# EAGLE design arm shield design (EAGLE 7.2.0)
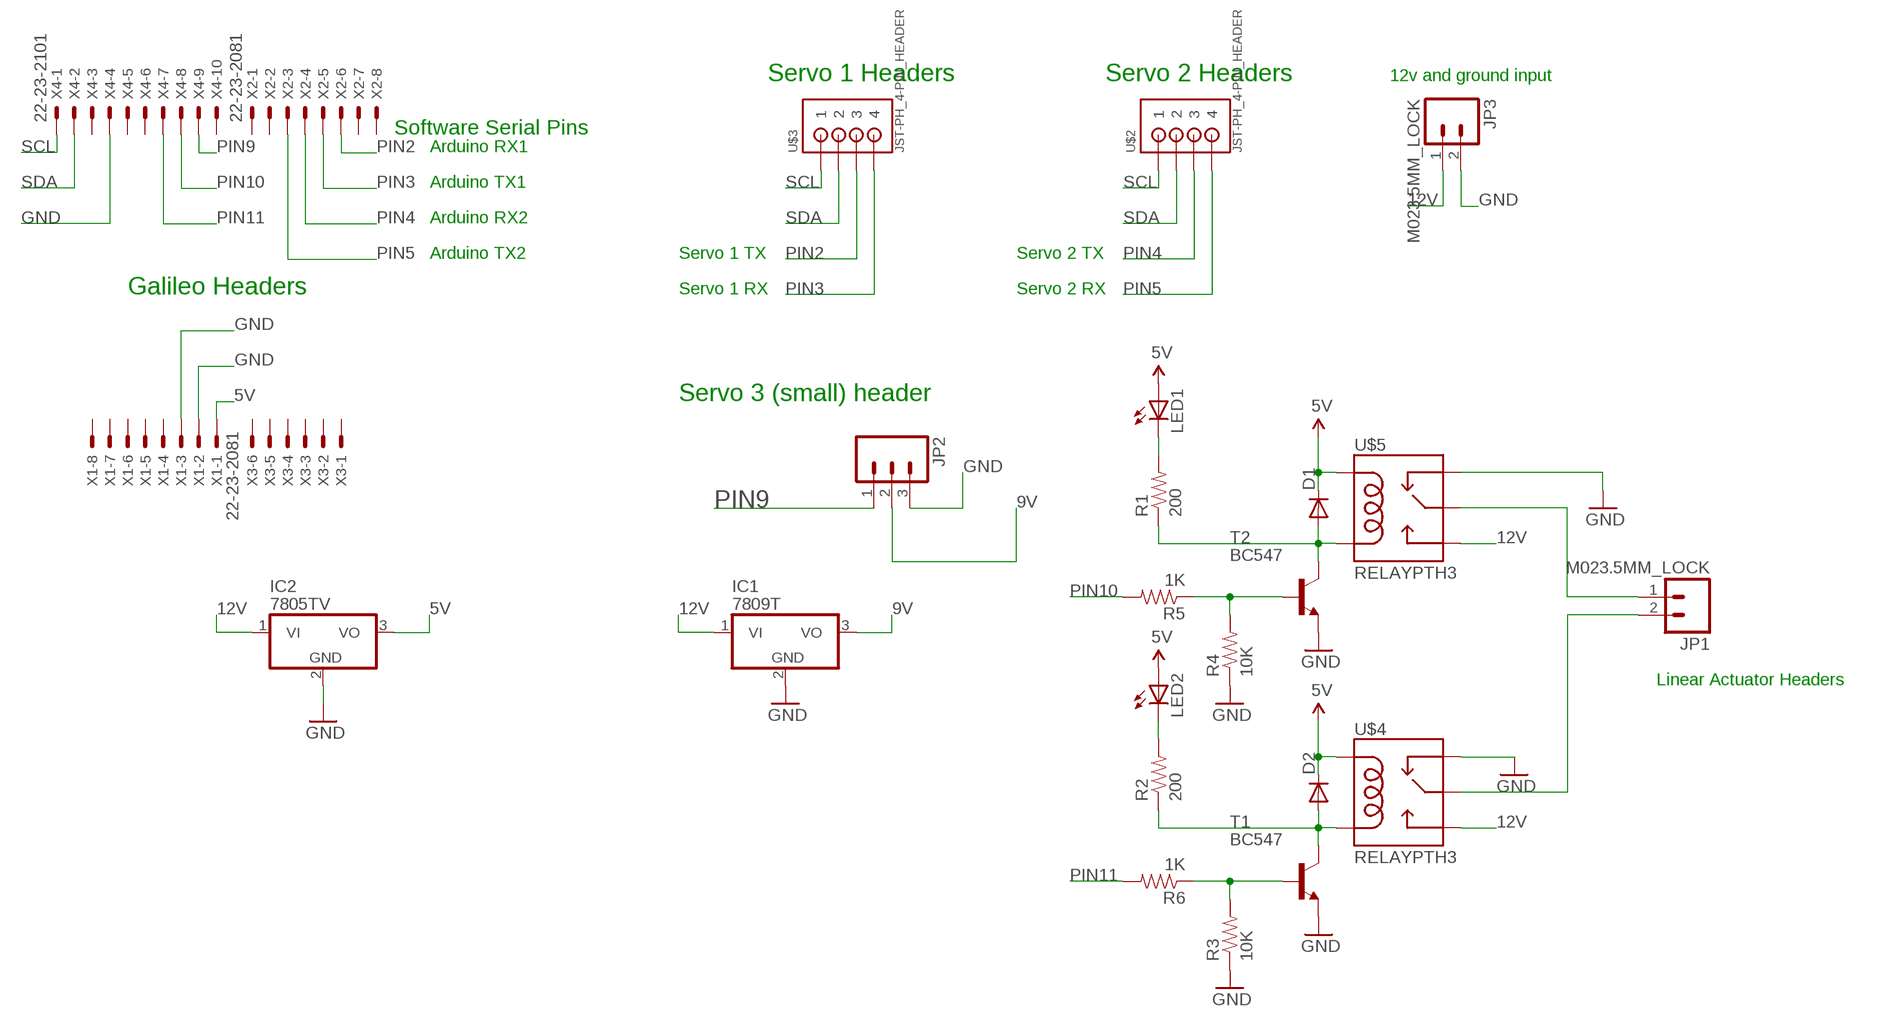
[diagram p0: schematic, sheet 1]

## Parts
D1  DIODE1N4148  [DIODE-1N4148]
D2  DIODE1N4148  [DIODE-1N4148]
IC1  7809T  7805TV  [TO220V]
IC2  7805TV  [TO220V]
JP1  M023.5MM_LOCK  [SCREWTERMINAL-3.5MM-2_LOCK]
JP2  M03PTH  [1X03]
JP3  M023.5MM_LOCK  [SCREWTERMINAL-3.5MM-2_LOCK]
LED1  LED3MM  [LED3MM]
LED2  LED3MM  [LED3MM]
R1  200  RESISTORPTH-1/4W-VERT  [AXIAL-0.1]
R2  200  RESISTORPTH-1/4W-VERT  [AXIAL-0.1]
R3  10K  RESISTORPTH-1/4W-VERT  [AXIAL-0.1]
R4  10K  RESISTORPTH-1/4W-VERT  [AXIAL-0.1]
R5  1K  RESISTORPTH-1/4W-VERT  [AXIAL-0.1]
R6  1K  RESISTORPTH-1/4W-VERT  [AXIAL-0.1]
T1  BC547  [TO92]
T2  BC547  [TO92]
U$2  JST-PH_4-PIN_HEADER  [JST_B4B-PH_HEADER]
U$3  JST-PH_4-PIN_HEADER  [JST_B4B-PH_HEADER]
U$4  RELAYPTH3  [RELAY-T9A-2]
U$5  RELAYPTH3  [RELAY-T9A-2]
X1  22-23-2081  [22-23-2081]
X2  22-23-2081  [22-23-2081]
X3  22-23-2061  [22-23-2061]
X4  22-23-2101  [22-23-2101]

## Nets
5V: D1.C D2.C IC2.3(VO) LED1.A LED2.A U$4.COIL1 U$5.COIL1 X1.1
9V [9VPower]: IC1.3(VO) JP2.2
12V [12VPower]: IC1.1(VI) IC2.1(VI) JP3.1 U$4.NO U$5.NO
GND [12VPower]: IC1.2(GND) IC2.2(GND) JP2.3 JP3.2 R3.P$1 R4.P$1 T1.1(E) T2.1(E) U$4.NC U$5.NC X1.2 X1.3 X4.4
N$1 [12VPower]: JP1.1 U$5.MAIN
N$2 [12VPower]: JP1.2 U$4.MAIN
N$3: D1.A R1.P$1 T2.3(C) U$5.COIL2
N$4: D2.A R2.P$1 T1.3(C) U$4.COIL2
N$5: LED1.K(C) R1.P$2
N$6: R3.P$2 R6.P$1 T1.2(B)
N$7: LED2.K(C) R2.P$2
N$8: R4.P$2 R5.P$1 T2.2(B)
PIN2: U$3.P3 X2.6
PIN3: U$3.P4 X2.5
PIN4: U$2.P3 X2.4
PIN5: U$2.P4 X2.3
PIN9: JP2.1 X4.9
PIN10: R5.P$2 X4.8
PIN11: R6.P$2 X4.7
SCL: U$2.P1 U$3.P1 X4.1
SDA: U$2.P2 U$3.P2 X4.2
Unconnected: X1.4 X1.5 X1.6 X1.7 X1.8 X2.1 X2.2 X2.7 X2.8 X3.1 X3.2 X3.3 X3.4 X3.5 X3.6 X4.3 X4.5 X4.6 X4.10

## Notes on the sheet
- Servo 1 Headers | Servo 2 Headers | 12v and ground input
- Software Serial Pins
- Arduino RX1
- Arduino TX1
- Arduino RX2
- Arduino TX2 | Servo 1 TX | Servo 2 TX
- Galileo Headers | Servo 1 RX | Servo 2 RX
- Servo 3 (small) header
- Linear Actuator Headers

## Library data of the parts
D1 D2 = SparkFun-DiscreteSemi:DIODE: Diode These are standard reverse protection diodes and small signal diodes. SMA package can handle up to about 1A. SOD-323 can handle about 200mA. What the SOD-323 package when ordering, there are some mfgs out there that are 5-pin packages.
IC1 IC2 = linear:78*: Positive VOLTAGE REGULATOR Source: http://cache.national.com/ds/LM/LM78L05.pdf http://www.fairchildsemi.com/ds/LM/LM7805.pdf
JP1 JP3 = SparkFun-Connectors:M02: Standard 2-pin 0.1" header. Use with - straight break away headers ( PRT-00116) - right angle break away headers (PRT-00553) - swiss pins (PRT-00743) - machine pins (PRT-00117) - female headers (PRT-00115) Molex polarized connector foot print use with: PRT-08233 with associated crimp pins and housings. 2.54_SCREWTERM for use with PRT-10571. 3.5mm Screw Terminal footprints for PRT-08084 5mm Screw Terminal footprints for use with PRT-08433
JP2 = SparkFun-Connectors:M03: Header 3 Standard 3-pin 0.1" header. Use with straight break away headers (SKU : PRT-00116), right angle break away headers (PRT-00553), swiss pins (PRT-00743), machine pins (PRT-00117), and female headers (PRT-00115). Molex polarized connector foot print use with SKU : PRT-08232 with associated crimp pins and housings.
LED1 LED2 = SparkFun-LED:LED: LEDs Standard schematic elements and footprints for 5mm, 3mm, 1206, and 0603 sized LEDs. 5mm - Spark Fun Electronics SKU : COM-00529 (and others)
R1-R6 = SparkFun-Resistors:RESISTOR: Resistor Basic schematic elements and footprints for 0603, 1206, and PTH resistors.
T1 T2 = transistor:BC547: NPN TRANSISTOR
U$2 U$3 = SRG:JST-PH_4-PIN_HEADER: 4-pin JST PH Shrouded Header, top entry P/N B4B-PH-K-S Mating connector PHR-4 Mating cable assembly: Sparkfun PRT-09916 <http://www.sparkfun.com/products/9916>; MPN: S4B-PH-K-S(LF)(SN)
U$4 U$5 = SparkFun-Electromechanical:RELAY: SPDT relay (COM-00101)
X1 X2 = con-molex:22-23-2081: .100" (2.54mm) Center Header - 8 Pin; MF: MOLEX; MPN: 22-23-2081; OC_FARNELL: 1756826; OC_NEWARK: 01C7592
X3 = con-molex:22-23-2061: .100" (2.54mm) Center Header - 6 Pin; MF: MOLEX; MPN: 22-23-2061; OC_FARNELL: 1462922; OC_NEWARK: 27C1933
X4 = con-molex:22-23-2101: .100" (2.54mm) Center Header - 10 Pin; MF: MOLEX; MPN: 22-23-2101; OC_FARNELL: 1756828; OC_NEWARK: 94C0765

## Net classes
1 12VPower: width 5.08 mm
2 9VPower: width 1.778 mm

## Board
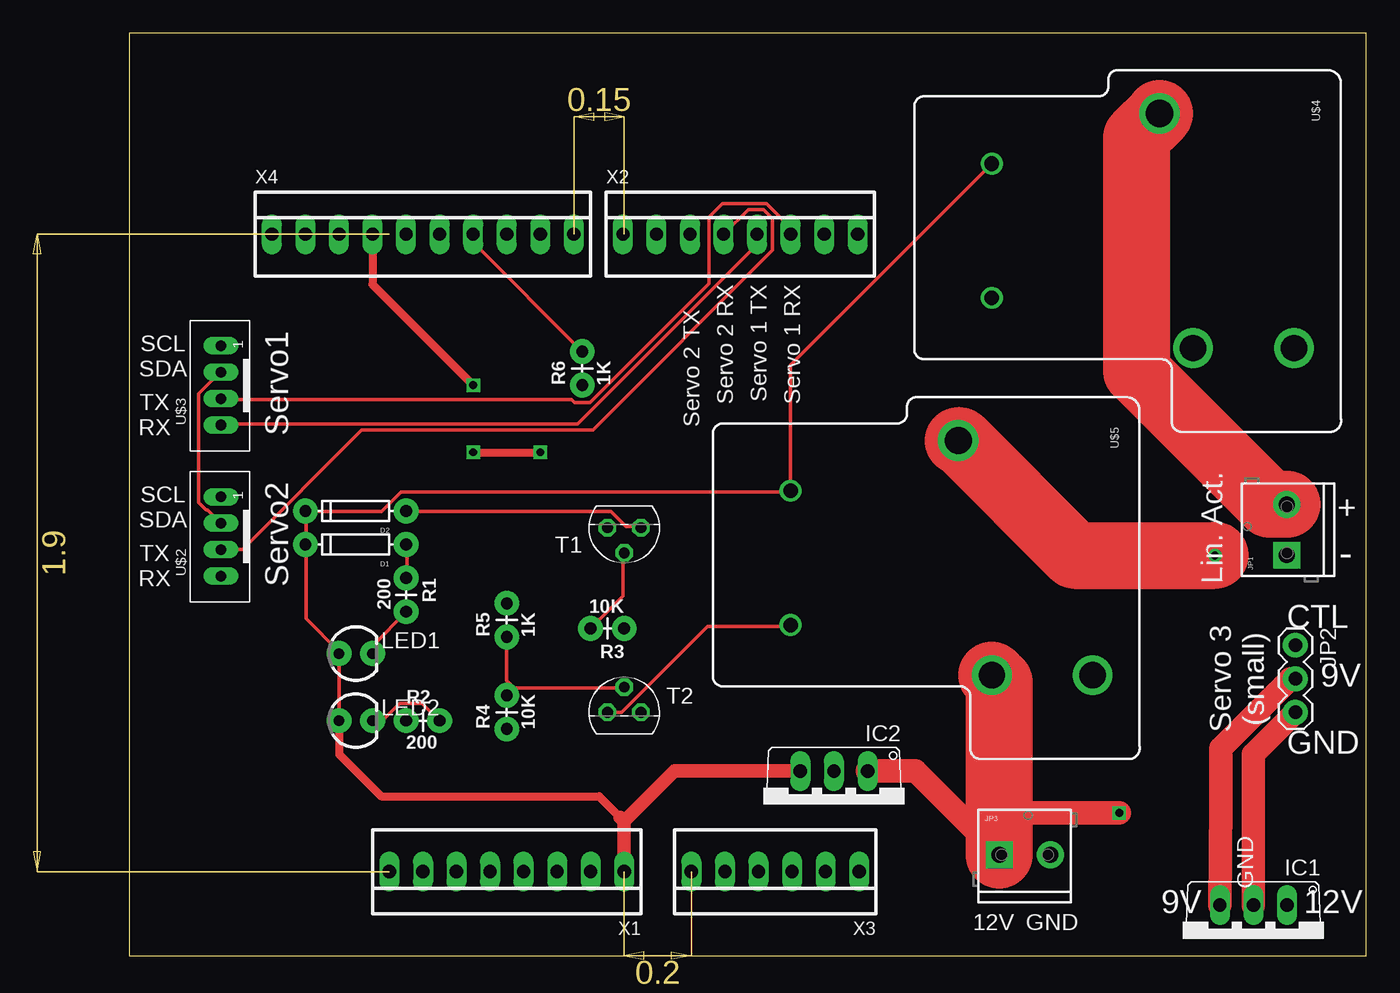
[diagram p1: board, top side]
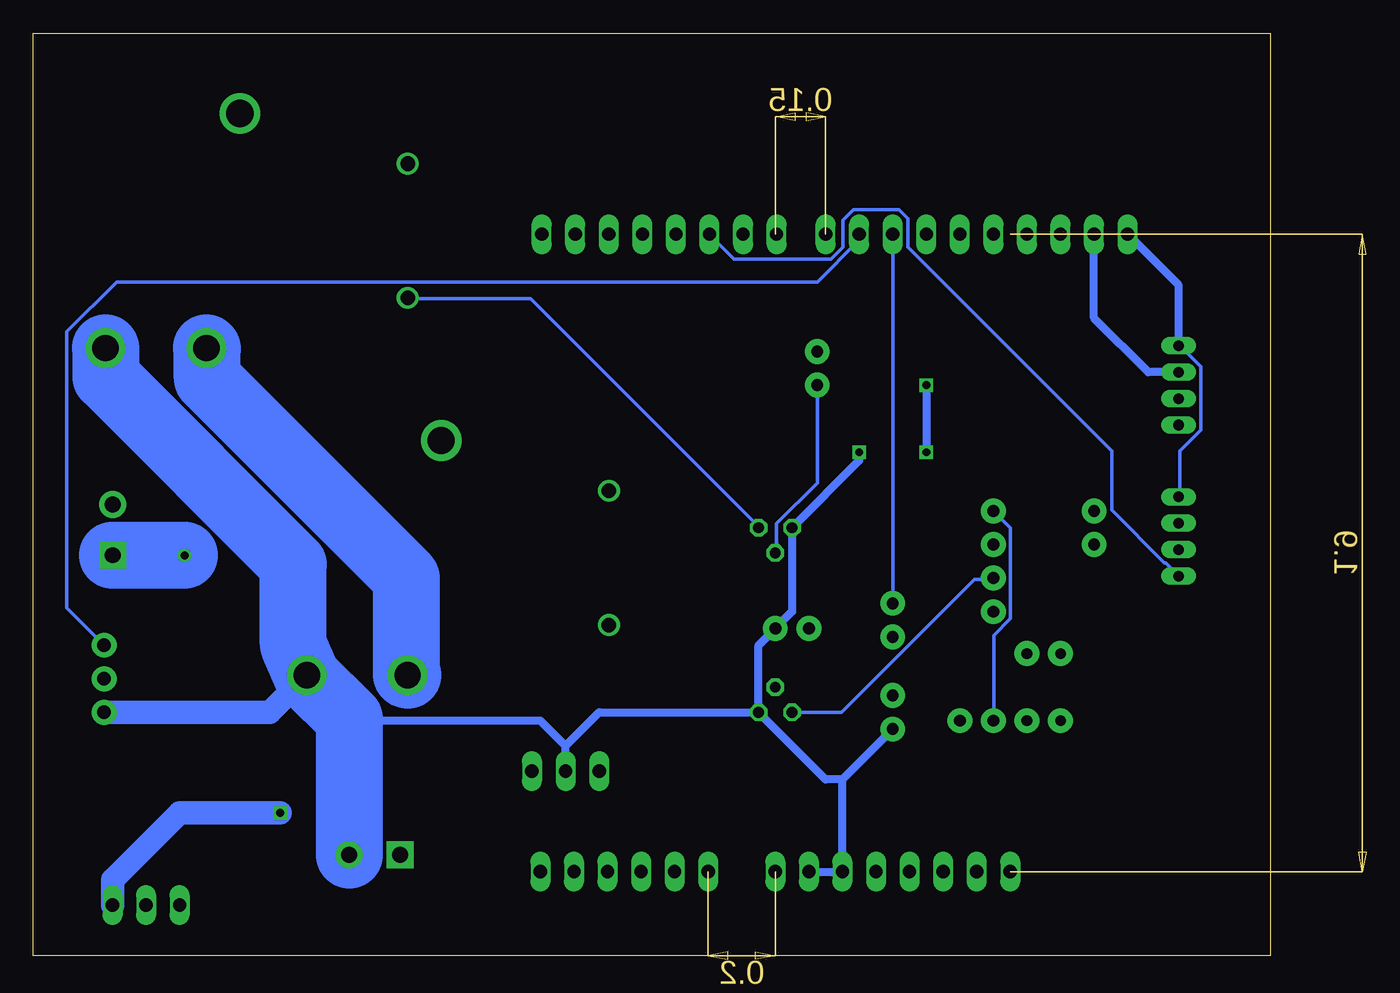
[diagram p2: board, bottom side, seen from below]

Size 93.65 x 69.84 mm. Coordinates in mm from the lower left corner, seen from the top.
Outline: 0,0 93.65,0 93.65,69.84 0,69.84 0,0
Copper layers (1*16): Top 0.035mm / dielectric 1.5mm / Bottom 0.035mm
Design rules "default": minimum track width 10mil, minimum drill 24mil, track to track 8mil, track to pad 8mil, pad to pad 8mil, via to via 8mil, smd to smd 8mil, copper to edge 40mil, drill to drill 8mil, minimum pad ring 10mil, minimum via ring 8mil, stop-mask expansion 4mil, vias tented up to drill 0mil, thermal gap 10mil

### Footprints (pad centres in the part's own frame; a part is rotated, then mirrored left to right if it is on the bottom)
DIODE-1N4148 = drill 0.9 pad 1.88: A -3.81,0; C 3.81,0
TO220V = drill 1.016 long: 1 -2.54,-2.54; 2 0,-2.54; 3 2.54,-2.54
SCREWTERMINAL-3.5MM-2_LOCK = drill 1.2 pad 2.032 square: 1 -0.178,0 | drill 1.2 pad 2.032: 2 3.678,0
1X03 = drill 1.016 pad 1.88: 1 0,0; 2 2.54,0; 3 5.08,0
LED3MM = drill 0.813 pad 1.88: A -1.27,0; K 1.27,0
AXIAL-0.1 = drill 0.9 pad 1.88: P$1 0,0; P$2 2.54,0
TO92 = drill 0.813 octagon: 1 1.27,0; 2 0,1.905; 3 -1.27,0
JST_B4B-PH_HEADER = drill 0.8 long: P1 2.98,0.048; P2 0.98,0.048; P3 -1.02,0.048; P4 -3.02,0.048
RELAY-T9A-2 = drill 1.1: COIL1 -6.61,-10.27; COIL2 3.55,-10.27 | drill 2.057: MAIN -10.41,2.43 | drill 2: NC 7.35,12.6; NO 7.35,4.97
22-23-2081 = drill 1 long: 1 -8.89,0; 2 -6.35,0; 3 -3.81,0; 4 -1.27,0; 5 1.27,0; 6 3.81,0; 7 6.35,0; 8 8.89,0
22-23-2061 = drill 1 long: 1 -6.35,0; 2 -3.81,0; 3 -1.27,0; 4 1.27,0; 5 3.81,0; 6 6.35,0
22-23-2101 = drill 1 long: 1 -11.43,0; 2 -8.89,0; 3 -6.35,0; 4 -3.81,0; 5 -1.27,0; 6 1.27,0; 7 3.81,0; 8 6.35,0; 9 8.89,0; 10 11.43,0

### Placement (x,y rotation side)
D1  17.14,31.11 180 top
D2  17.14,33.66 180 top
IC1  85.09,1.27 180 top
IC2  53.34,11.43 180 top
JP1  87.63,30.48 90 top
JP2  88.27,23.5 270 top
JP3  66.04,7.62 0 top
LED1  17.14,22.86 0 top
LED2  17.14,17.78 0 top
R1  20.95,28.57 270 top
R2  20.95,17.78 0 top
R3  37.47,24.77 180 top
R4  28.57,17.14 90 top
R5  28.57,24.13 90 top
R6  34.29,43.18 90 top
T1  37.47,32.38 180 top
T2  37.47,18.41 0 top
U$2  6.99,31.75 90 top
U$3  6.99,43.18 90 top
U$4  75.56,53.34 270 top
U$5  60.33,28.57 270 top
X1  28.57,6.35 180 top
X2  46.26,54.61 0 top
X3  48.9,6.35 180 top
X4  22.23,54.61 0 top

### Tracks (layer width: path | path; a pad name or v marks a point on that pad's centre or on a via)
5V
  Top 0.254: LED2.A 15.89,17.84 15.89,22.76 LED1.A 15.89,22.99 13.37,25.5 13.37,31.1 D1.C 13.37,31.22 13.37,33.62 D2.C 13.49,33.62 19.09,33.62 20.57,35.1 49.95,35.1 U$5.COIL1 50.06,35.22 50.06,44.7 65.27,59.91 U$4.COIL1
  Top 0.61: 15.89,17.84 15.89,15.23 19.05,12.06 35.56,12.06 37.15,10.48
  Top 1.016: IC2.3 41.27,13.97 37.47,10.16 | X1.1 37.47,10.16 | 37.47,10.16 37.15,10.48
9V
  Top 1.778: IC1.3 82.64,11.44 82.64,15.67 87.9,20.93 88.24,20.93 JP2.2
12V  (via drill 0.6)
  Top 1.778: v74.93,10.79 65.84,10.79 | IC2.1 59.51,13.97 JP3.1
  Top 5.08: JP3.1 65.84,7.66 65.84,10.79 65.84,20.69 65.38,21.14 U$5.NO
  Bottom 1.778: IC1.1 87.63,5.71 82.55,10.79 v74.93,10.79
  Bottom 5.08: U$4.NO 80.47,45.95 80.47,43.66 65.38,28.57 65.38,21.26 U$5.NO
GND  (via drill 0.6)
  Top 0.61: X4.4 18.41,50.8 v26.04,43.18 | v26.04,38.1 v31.11,38.1
  Top 1.778: JP2.3 85.09,15.24 IC1.2
  Bottom 0.61: 32.38,13.34 X1.3 X1.2 | 32.38,13.34 R4.P$1 | 32.38,13.34 33.66,13.34 T2.1 | v26.04,43.18 v26.04,38.1 | v31.11,38.1 31.11,37.47 T1.1 36.2,26.04 R3.P$1 38.73,23.5 T2.1 | 53.34,15.88 50.8,18.41 T2.1 | IC2.2 53.34,15.88 | 53.34,15.88 55.24,17.78 69.72,17.78
  Bottom 1.778: JP2.3 75.73,18.41 U$5.NC
  Bottom 5.08: JP3.2 69.72,7.66 69.72,17.78 69.72,17.95 72.92,21.14 U$5.NC 73.95,23.55 73.95,29.6 88.12,43.78 88.12,45.95 U$4.NC
N$1  (via drill 0.61)
  Top 5.08: v82.18,30.29 71.55,30.29 62.87,38.98 U$5.MAIN
  Bottom 5.08: v82.18,30.29 87.55,30.29 JP1.1
N$2
  Top 5.08: JP1.2 87.55,34.18 86.3,34.18 76.24,44.23 76.24,61.95 77.95,63.66 U$4.MAIN
N$3
  Top 0.254: R1.P$1 21.03,28.59 21.03,31.1 D1.A | T2.3 37.26,18.41 43.78,24.93 49.95,24.93 U$5.COIL2
  Bottom 0.254: T2.3 32.46,18.41 22.4,28.47 21.03,28.47 R1.P$1
N$4
  Top 0.254: T1.3 38.63,32.47 37.6,32.47 36.46,33.62 21.03,33.62 D2.A
  Bottom 0.254: U$4.COIL2 65.27,49.73 56.01,49.73 38.75,32.47 T1.3 | D2.A 19.66,32.36 19.66,25.5 20.92,24.24 20.92,17.84 R2.P$1
N$5
  Top 0.254: LED1.K 18.52,22.87 18.52,23.56 20.92,25.96 R1.P$2
N$6
  Top 0.254: R3.P$2 37.38,27.22 37.38,30.42 T1.2
  Bottom 0.254: R6.P$1 34.29,35.79 37.38,32.7 37.38,30.53 T1.2
N$7
  Top 0.254: R2.P$2 22.17,19.1 20.46,19.1 19.2,17.84 18.52,17.84 LED2.K
N$8
  Top 0.254: T2.2 37.38,20.24 29.03,20.24 28.57,19.79 R4.P$2 29.03,20.36 28.57,20.82 R5.P$1
PIN2
  Top 0.254: U$3.P3 6.97,42.08 33.49,42.08 33.72,41.85 34.86,41.85 43.89,50.88 43.89,55.91 44.92,56.93 48.23,56.93 50.06,55.1 50.06,54.65 X2.6
PIN3
  Top 0.254: U$3.P4 6.97,40.25 33.95,40.25 47.43,53.73 47.43,54.53 X2.5
PIN4
  Top 0.254: U$2.P3 6.97,30.76 8.57,30.76 17.6,39.79 35.09,39.79 48.69,53.39 48.69,55.79 48.01,56.48 46.86,56.48 45.03,54.65 X2.4
PIN5
  Bottom 0.254: U$2.P4 6.97,28.82 7.89,29.73 8,29.73 12,33.73 12,38.19 27.43,53.62 27.43,55.79 28.12,56.48 31.55,56.48 32.35,55.68 32.35,53.62 33.26,52.7 40.58,52.7 42.41,54.53 X2.3
PIN9
  Bottom 0.254: X4.9 31.2,54.53 31.2,54.08 34.29,50.99 87.33,50.99 91.1,47.22 91.1,26.3 88.35,23.56 JP2.1
PIN10
  Bottom 0.254: R5.P$2 X4.8
PIN11
  Top 0.254: X4.7 26.06,54.53 26.06,53.96 34.29,45.73 R6.P$2
SCL
  Bottom 0.254: U$2.P1 6.86,34.76 6.86,38.19 5.26,39.79 5.26,44.59 6.86,46.19 U$3.P1
  Bottom 0.61: U$3.P1 6.94,50.75 X4.1
SDA
  Top 0.254: U$2.P2 6.86,32.82 5.94,33.73 5.83,33.73 5.26,34.3 5.26,42.53 6.86,44.13 U$3.P2
  Bottom 0.61: U$3.P2 9.23,44.16 13.34,48.26 X4.2

### Text on the board
tNames: Servo 2 RX | Servo 1 TX | Servo 1 RX | Servo 2 TX | SCL | SDA | TX | RX | Servo1 | SCL | SDA | + | Lin. Act. | TX | - | RX | Servo2 | CTL | Servo 3 / (small) | 9V | GND | GND | 12V | GND | 9V | 12V